# Altium schematic sheet Mainboard_User LED2 Connector.SchDoc
size A4
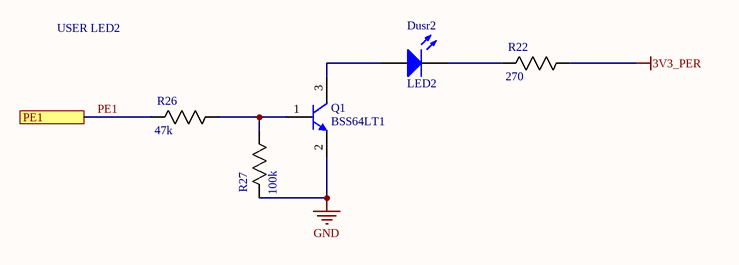
[diagram p0: Mainboard_User LED2 Connector.SchDoc]

## Parts
Dusr2  LED2  [3.2X1.6X1.1]
Q1  BSS64LT1  [ONSC-SOT-23-3-318-08_V]
R22  270  [0805]
R26  47k  [0805]
R27  100k  [0805]

## Ports
PE1

## Nets
3V3_PER: R22.1(R1)
GND: Q1.2(E) R27.2(R2)
PE1: R26.2(R2) ; port PE1
NetDusr2_1: Dusr2.1(A) Q1.3(C)
NetDusr2_2: Dusr2.2(K) R22.2(R2)
NetQ1_1: Q1.1(B) R26.1(R1) R27.1(R1)

## Notes on the sheet
- USER LED2

## Library data of the parts
Dusr2 = LED GREEN SMD: Typical RED, GREEN, YELLOW, AMBER GaAs LED; Voltage - Forward (Vf) (Typ): 2V; Lens Transparency: Clear; Current - Test: 20mA; Package: 1206; Color: Green
Q1 = CMP-1048-00605-1: Driver Transistor, NPN Silicon, 3-Pin SOT-23, Tape and Reel; Manufacturer: On Semiconductor; IC Continuous (A): 0.1; fT Min (MHz): 60; ComponentLink1Description: Manufacturer URL; ComponentLink3Description: Package Specification; ComponentLink2URL: http://www.onsemi.com/pub_link/Collateral/BSS64LT1-D.PDF; ComponentLink1URL: http://www.onsemi.com/; ComponentLink2Description: Datasheet; ComponentLink3URL: http://www.onsemi.cn/pub_link/Collateral/318-08.PDF; RoHS: FALSE; PackageVersion: Rev. AP, 11/2009; Polarity: NPN; PartNumber: BSS64LT1; Mounting Technology: Surface Mount; PackageDescription: 3-Pin Small Outline Transistor, Body 2.92 x 1.3 mm, Pitch 0.95 mm; Packing: Tape and Reel; DatasheetVersion: Rev. 5; PackageReference: SOT-23-3-318-08
R22 = RES 270.0 1/8W: RES SMD 270 OHM 5% 1/8W 0805; Power (Watts): 0.125W; Package: 0805; Value: 270; Tolerance: 5%
R26 = RES 47k 1/8W - 1%: RES SMD 47K OHM 1% 1/8W 0805; Power (Watts): 0.125W; Package: 0805; Value: 47k; Tolerance: 1%
R27 = RES 100k 1/8W - 1%: RES SMD 100K OHM 1% 1/8W 0805; Power (Watts): 0.125W; Package: 0805; Value: 100k; Tolerance: 1%